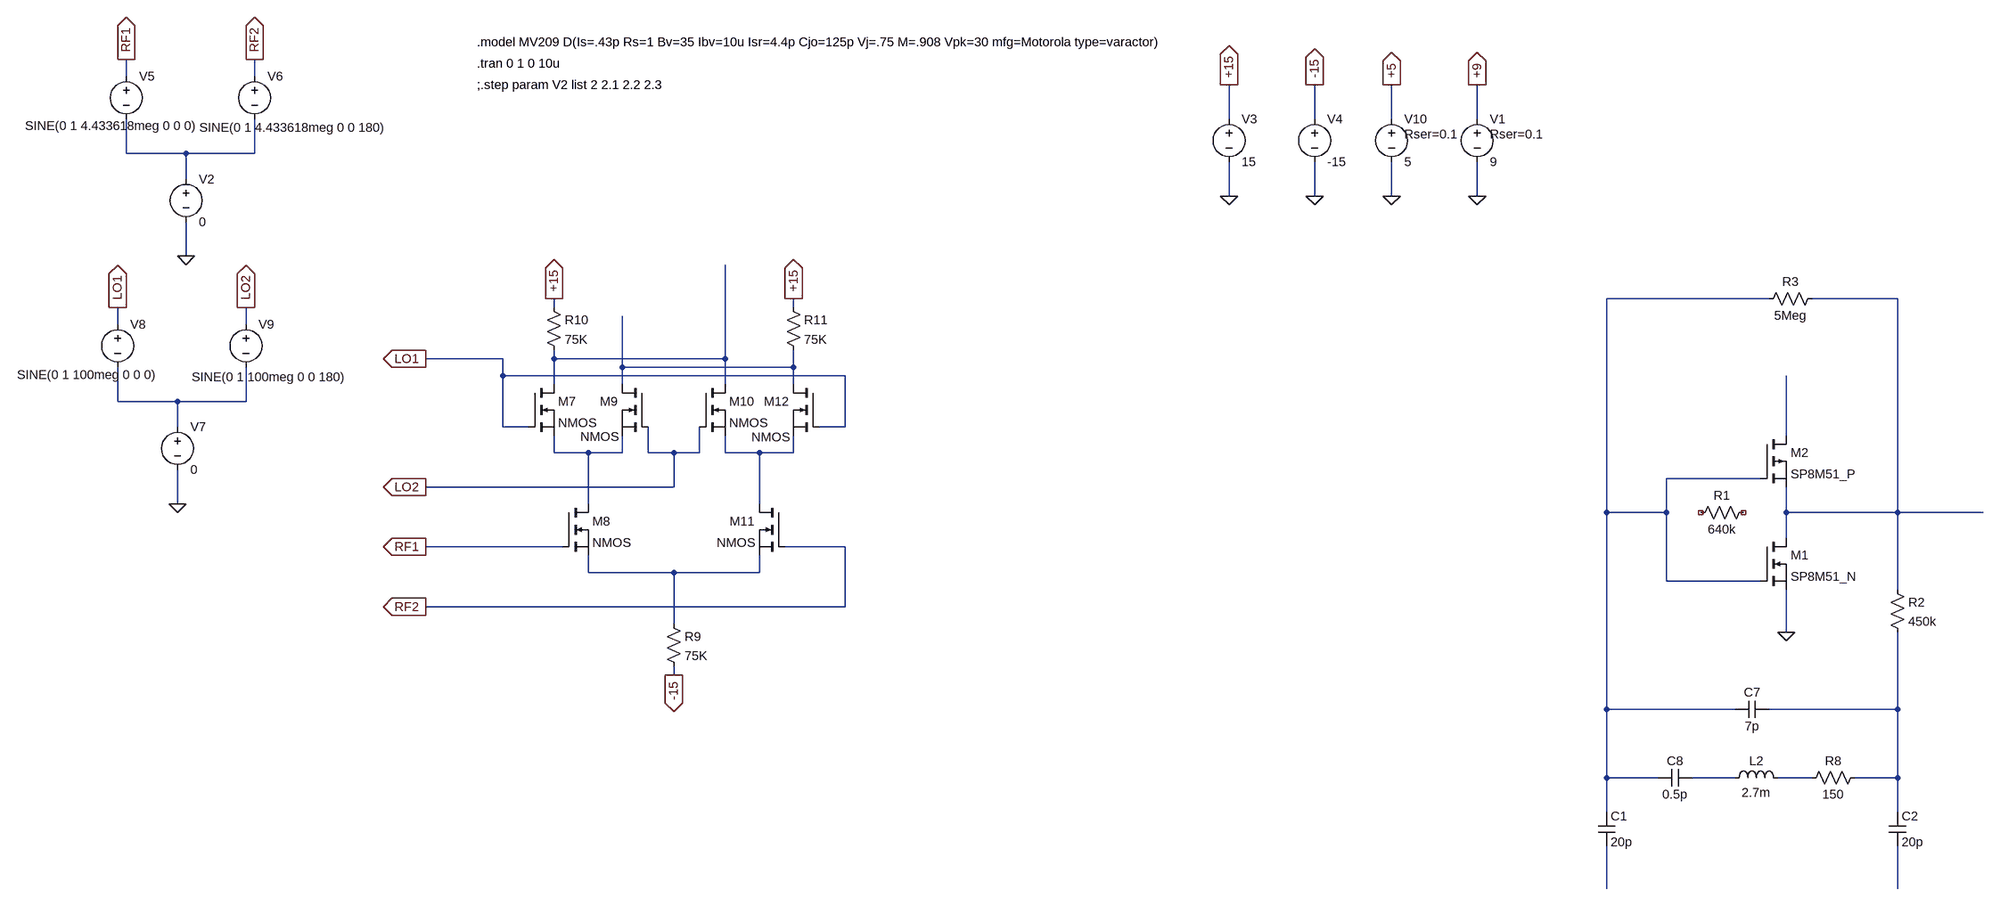
[diagram p0: schematic Colpitts_Cystal_OSC.asc]
Colpitts_Cystal_OSC.asc, the LTspice schematic file:
Version 4
SHEET 1 2868 1316
WIRE -2352 -352 -2352 -384
WIRE -2112 -352 -2112 -384
WIRE 112 -272 112 -336
WIRE 272 -272 272 -336
WIRE 416 -272 416 -336
WIRE 576 -272 576 -336
WIRE -2352 -208 -2352 -272
WIRE -2240 -208 -2352 -208
WIRE -2112 -208 -2112 -272
WIRE -2112 -208 -2240 -208
WIRE -2240 -160 -2240 -208
WIRE 112 -128 112 -192
WIRE 272 -128 272 -192
WIRE 416 -128 416 -192
WIRE 576 -128 576 -192
WIRE -2240 -16 -2240 -80
WIRE 1232 64 928 64
WIRE 1472 64 1312 64
WIRE -1552 80 -1552 64
WIRE -1104 80 -1104 64
WIRE -2368 112 -2368 80
WIRE -2128 112 -2128 80
WIRE -1648 176 -1792 176
WIRE -1552 176 -1552 160
WIRE -1232 176 -1232 0
WIRE -1232 176 -1552 176
WIRE -1424 192 -1424 96
WIRE -1104 192 -1104 160
WIRE -1104 192 -1424 192
WIRE -1648 208 -1648 176
WIRE -1008 208 -1648 208
WIRE -1552 224 -1552 176
WIRE -1424 224 -1424 192
WIRE -1232 224 -1232 176
WIRE -1104 224 -1104 192
WIRE -2368 256 -2368 192
WIRE -2256 256 -2368 256
WIRE -2128 256 -2128 192
WIRE -2128 256 -2256 256
WIRE -2256 304 -2256 256
WIRE -1648 304 -1648 208
WIRE -1600 304 -1648 304
WIRE -1008 304 -1008 208
WIRE -1008 304 -1056 304
WIRE 1264 320 1264 208
WIRE -1552 352 -1552 320
WIRE -1488 352 -1552 352
WIRE -1424 352 -1424 320
WIRE -1424 352 -1488 352
WIRE -1376 352 -1376 304
WIRE -1328 352 -1376 352
WIRE -1280 352 -1280 304
WIRE -1280 352 -1328 352
WIRE -1232 352 -1232 320
WIRE -1168 352 -1232 352
WIRE -1104 352 -1104 320
WIRE -1104 352 -1168 352
WIRE 1216 400 1040 400
WIRE -1328 416 -1328 352
WIRE -1328 416 -1792 416
WIRE -2256 448 -2256 384
WIRE -1488 448 -1488 352
WIRE -1168 448 -1168 352
WIRE 928 464 928 64
WIRE 1040 464 1040 400
WIRE 1040 464 928 464
WIRE 1264 464 1264 416
WIRE 1472 464 1472 64
WIRE 1472 464 1264 464
WIRE 1632 464 1472 464
WIRE 1264 512 1264 464
WIRE -1536 528 -1792 528
WIRE -1008 528 -1120 528
WIRE -1488 576 -1488 544
WIRE -1328 576 -1488 576
WIRE -1168 576 -1168 544
WIRE -1168 576 -1328 576
WIRE 1040 592 1040 464
WIRE 1216 592 1040 592
WIRE 1472 608 1472 464
WIRE -1008 640 -1008 528
WIRE -1008 640 -1792 640
WIRE -1328 672 -1328 576
WIRE 1264 688 1264 608
WIRE -1328 768 -1328 752
WIRE 928 832 928 464
WIRE 1168 832 928 832
WIRE 1472 832 1472 688
WIRE 1472 832 1232 832
WIRE 928 960 928 832
WIRE 1024 960 928 960
WIRE 1168 960 1088 960
WIRE 1312 960 1248 960
WIRE 1472 960 1472 832
WIRE 1472 960 1392 960
WIRE 928 1024 928 960
WIRE 1472 1024 1472 960
WIRE 928 1168 928 1088
WIRE 1472 1168 1472 1088
FLAG -1328 768 -15
IOPIN -1328 768 Out
FLAG -1552 64 +15
IOPIN -1552 64 Out
FLAG -1104 64 +15
IOPIN -1104 64 Out
FLAG 112 -336 +15
IOPIN 112 -336 Out
FLAG 112 -128 0
FLAG 272 -336 -15
IOPIN 272 -336 Out
FLAG 272 -128 0
FLAG -2240 -16 0
FLAG -2352 -384 RF1
IOPIN -2352 -384 Out
FLAG -2112 -384 RF2
IOPIN -2112 -384 Out
FLAG -2256 448 0
FLAG -2368 80 LO1
IOPIN -2368 80 Out
FLAG -2128 80 LO2
IOPIN -2128 80 Out
FLAG -1792 176 LO1
IOPIN -1792 176 Out
FLAG -1792 416 LO2
IOPIN -1792 416 Out
FLAG 416 -336 +5
IOPIN 416 -336 Out
FLAG 416 -128 0
FLAG 576 -336 +9
IOPIN 576 -336 Out
FLAG 576 -128 0
FLAG 1264 688 0
FLAG -1792 528 RF1
IOPIN -1792 528 Out
FLAG -1792 640 RF2
IOPIN -1792 640 Out
SYMBOL cap 1168 848 R270
WINDOW 0 32 32 VTop 2
WINDOW 3 0 32 VBottom 2
SYMATTR InstName C7
SYMATTR Value 7p
SYMBOL cap 1024 976 R270
WINDOW 0 32 32 VTop 2
WINDOW 3 0 32 VBottom 2
SYMATTR InstName C8
SYMATTR Value 0.5p
SYMBOL ind 1152 976 R270
WINDOW 0 32 56 VTop 2
WINDOW 3 4 56 VBottom 2
SYMATTR InstName L2
SYMATTR Value 2.7m
SYMBOL res 1296 976 R270
WINDOW 0 32 56 VTop 2
WINDOW 3 0 56 VBottom 2
SYMATTR InstName R8
SYMATTR Value 150
SYMBOL nmos -1600 224 R0
SYMATTR InstName M7
SYMBOL nmos -1536 448 R0
SYMATTR InstName M8
SYMBOL nmos -1376 224 M0
WINDOW 3 55 98 Left 2
SYMATTR InstName M9
SYMBOL nmos -1280 224 R0
SYMATTR InstName M10
SYMBOL nmos -1120 448 M0
SYMATTR InstName M11
SYMBOL nmos -1056 224 M0
WINDOW 3 55 99 Left 2
SYMATTR InstName M12
SYMBOL res -1344 656 R0
SYMATTR InstName R9
SYMATTR Value 75K
SYMBOL res -1568 64 R0
SYMATTR InstName R10
SYMATTR Value 75K
SYMATTR SpiceLine tol=1 pwr=0.1
SYMBOL res -1120 64 R0
SYMATTR InstName R11
SYMATTR Value 75K
SYMATTR SpiceLine tol=1 pwr=0.1
SYMBOL voltage 112 -288 R0
WINDOW 123 0 0 Left 0
WINDOW 39 0 0 Left 0
SYMATTR InstName V3
SYMATTR Value 15
SYMBOL voltage 272 -288 R0
WINDOW 123 0 0 Left 0
WINDOW 39 0 0 Left 0
SYMATTR InstName V4
SYMATTR Value -15
SYMBOL voltage -2240 -176 R0
WINDOW 123 0 0 Left 0
WINDOW 39 0 0 Left 0
SYMATTR InstName V2
SYMATTR Value 0
SYMBOL voltage -2352 -368 R0
WINDOW 3 -189 108 Left 2
WINDOW 123 0 0 Left 0
WINDOW 39 0 0 Left 0
SYMATTR Value SINE(0 1 4.433618meg 0 0 0)
SYMATTR InstName V5
SYMBOL voltage -2112 -368 R0
WINDOW 3 -103 112 Left 2
WINDOW 123 0 0 Left 0
WINDOW 39 0 0 Left 0
SYMATTR Value SINE(0 1 4.433618meg 0 0 180)
SYMATTR InstName V6
SYMBOL voltage -2256 288 R0
WINDOW 123 0 0 Left 0
WINDOW 39 0 0 Left 0
SYMATTR InstName V7
SYMATTR Value 0
SYMBOL voltage -2368 96 R0
WINDOW 3 -188 110 Left 2
WINDOW 123 0 0 Left 0
WINDOW 39 0 0 Left 0
SYMATTR Value SINE(0 1 100meg 0 0 0)
SYMATTR InstName V8
SYMBOL voltage -2128 96 R0
WINDOW 3 -101 114 Left 2
WINDOW 123 0 0 Left 0
WINDOW 39 0 0 Left 0
SYMATTR Value SINE(0 1 100meg 0 0 180)
SYMATTR InstName V9
SYMBOL voltage 416 -288 R0
WINDOW 123 0 0 Left 0
WINDOW 39 24 44 Left 2
SYMATTR SpiceLine Rser=0.1
SYMATTR InstName V10
SYMATTR Value 5
SYMBOL voltage 576 -288 R0
WINDOW 123 0 0 Left 0
WINDOW 39 24 44 Left 2
SYMATTR SpiceLine Rser=0.1
SYMATTR InstName V1
SYMATTR Value 9
SYMBOL res 1456 592 R0
SYMATTR InstName R2
SYMATTR Value 450k
SYMBOL cap 912 1024 R0
SYMATTR InstName C1
SYMATTR Value 20p
SYMBOL cap 1456 1024 R0
SYMATTR InstName C2
SYMATTR Value 20p
SYMBOL nmos 1216 512 R0
SYMATTR InstName M1
SYMATTR Value SP8M51_N
SYMBOL pmos 1216 320 R0
SYMATTR InstName M2
SYMATTR Value SP8M51_P
SYMBOL res 1200 448 R90
WINDOW 0 0 56 VBottom 2
WINDOW 3 32 56 VTop 2
SYMATTR InstName R1
SYMATTR Value 640k
SYMBOL res 1328 48 R90
WINDOW 0 0 56 VBottom 2
WINDOW 3 32 56 VTop 2
SYMATTR InstName R3
SYMATTR Value 5Meg
TEXT -1696 -376 Left 2 !.tran 0 1 0 10u
TEXT -1696 -336 Left 2 !;.step param V2 list 2 2.1 2.2 2.3
TEXT -1696 -416 Left 2 !.model MV209 D(Is=.43p Rs=1 Bv=35 Ibv=10u Isr=4.4p Cjo=125p Vj=.75 M=.908 Vpk=30 mfg=Motorola type=varactor)

The netlist it stands for:
* Colpitts_Cystal_OSC.asc
C7 N002 N011 7p
C8 N002 N012 0.5p
L2 N012 N013 2.7m
R8 N013 N011 150
M7 N004 LO1 N008 N008 NMOS
M8 N008 RF1 N010 N010 NMOS
M9 N005 LO2 N008 N008 NMOS
M10 N004 LO2 N009 N009 NMOS
M11 N009 RF2 N010 N010 NMOS
M12 N005 LO1 N009 N009 NMOS
R9 N010 -15 75K
R10 +15 N004 75K tol=1 pwr=0.1
R11 +15 N005 75K tol=1 pwr=0.1
V3 +15 0 15
V4 -15 0 -15
V2 N001 0 0
V5 RF1 N001 SINE(0 1 4.433618meg 0 0 0)
V6 RF2 N001 SINE(0 1 4.433618meg 0 0 180)
V7 N006 0 0
V8 LO1 N006 SINE(0 1 100meg 0 0 0)
V9 LO2 N006 SINE(0 1 100meg 0 0 180)
V10 +5 0 5 Rser=0.1
V1 +9 0 9 Rser=0.1
R2 N003 N011 450k
C1 N002 N014 20p
C2 N011 N015 20p
M1 N003 N002 0 0 SP8M51_N
M2 N007 N002 N003 N003 SP8M51_P
R1 NC_01 NC_02 640k
R3 N003 N002 5Meg
.model NMOS NMOS
.model PMOS PMOS
.lib standard.mos
.tran 0 1 0 10u
;.step param V2 list 2 2.1 2.2 2.3
.model MV209 D(Is=.43p Rs=1 Bv=35 Ibv=10u Isr=4.4p Cjo=125p Vj=.75 M=.908 Vpk=30 mfg=Motorola type=varactor)
.backanno
.end